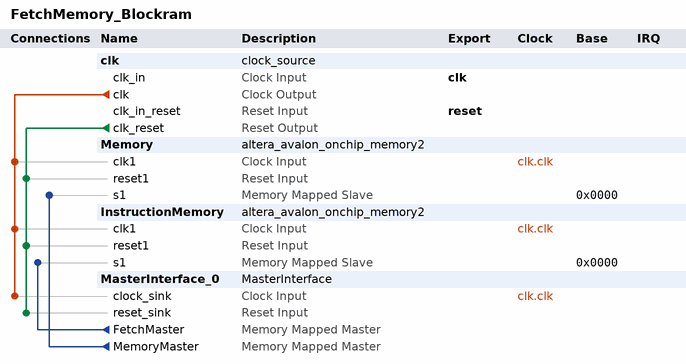
[diagram p0: system contents]
# Platform Designer (Qsys) system FetchMemory_Blockram, Cyclone II EP2C70F896C6
# Parameters at their usual value, and those the tool derives, are not listed.
package require -exact qsys 13.0.1.99.2
create_system FetchMemory_Blockram
set_project_property DEVICE_FAMILY {Cyclone II}
set_project_property DEVICE EP2C70F896C6

add_instance clk clock_source 13.0
set_instance_parameter_value clk clockFrequency 50000000

add_instance Memory altera_avalon_onchip_memory2 13.0.1.99.2
set_instance_parameter_value Memory dataWidth 32
set_instance_parameter_value Memory dualPort false
set_instance_parameter_value Memory initMemContent true
set_instance_parameter_value Memory initializationFileName onchip_mem.hex
set_instance_parameter_value Memory memorySize 4096

add_instance InstructionMemory altera_avalon_onchip_memory2 13.0.1.99.2
set_instance_parameter_value InstructionMemory dataWidth 32
set_instance_parameter_value InstructionMemory dualPort false
set_instance_parameter_value InstructionMemory initMemContent true
set_instance_parameter_value InstructionMemory initializationFileName test06mem.hex
set_instance_parameter_value InstructionMemory memorySize 4096
set_instance_parameter_value InstructionMemory useNonDefaultInitFile true
set_instance_parameter_value InstructionMemory writable false

add_instance MasterInterface_0 MasterInterface 1.0

# connections
add_connection clk.clk InstructionMemory.clk1 clock
add_connection clk.clk MasterInterface_0.clock_sink clock
add_connection clk.clk Memory.clk1 clock
add_connection clk.clk_reset InstructionMemory.reset1 reset
add_connection clk.clk_reset MasterInterface_0.reset_sink reset
add_connection clk.clk_reset Memory.reset1 reset
add_connection MasterInterface_0.FetchMaster InstructionMemory.s1 avalon
set_connection_parameter_value MasterInterface_0.FetchMaster/InstructionMemory.s1 baseAddress 0x0000
add_connection MasterInterface_0.MemoryMaster Memory.s1 avalon
set_connection_parameter_value MasterInterface_0.MemoryMaster/Memory.s1 baseAddress 0x0000

# exported interfaces
add_interface clk clock sink
set_interface_property clk EXPORT_OF clk.clk_in
add_interface reset reset sink
set_interface_property reset EXPORT_OF clk.clk_in_reset

set_interconnect_requirement {$system} qsys_mm.clockCrossingAdapter HANDSHAKE
set_interconnect_requirement {$system} qsys_mm.maxAdditionalLatency 1

save_system FetchMemory_Blockram.qsys
